# EAGLE schematic Seeeduino_V2.2 (EAGLE 5.11)
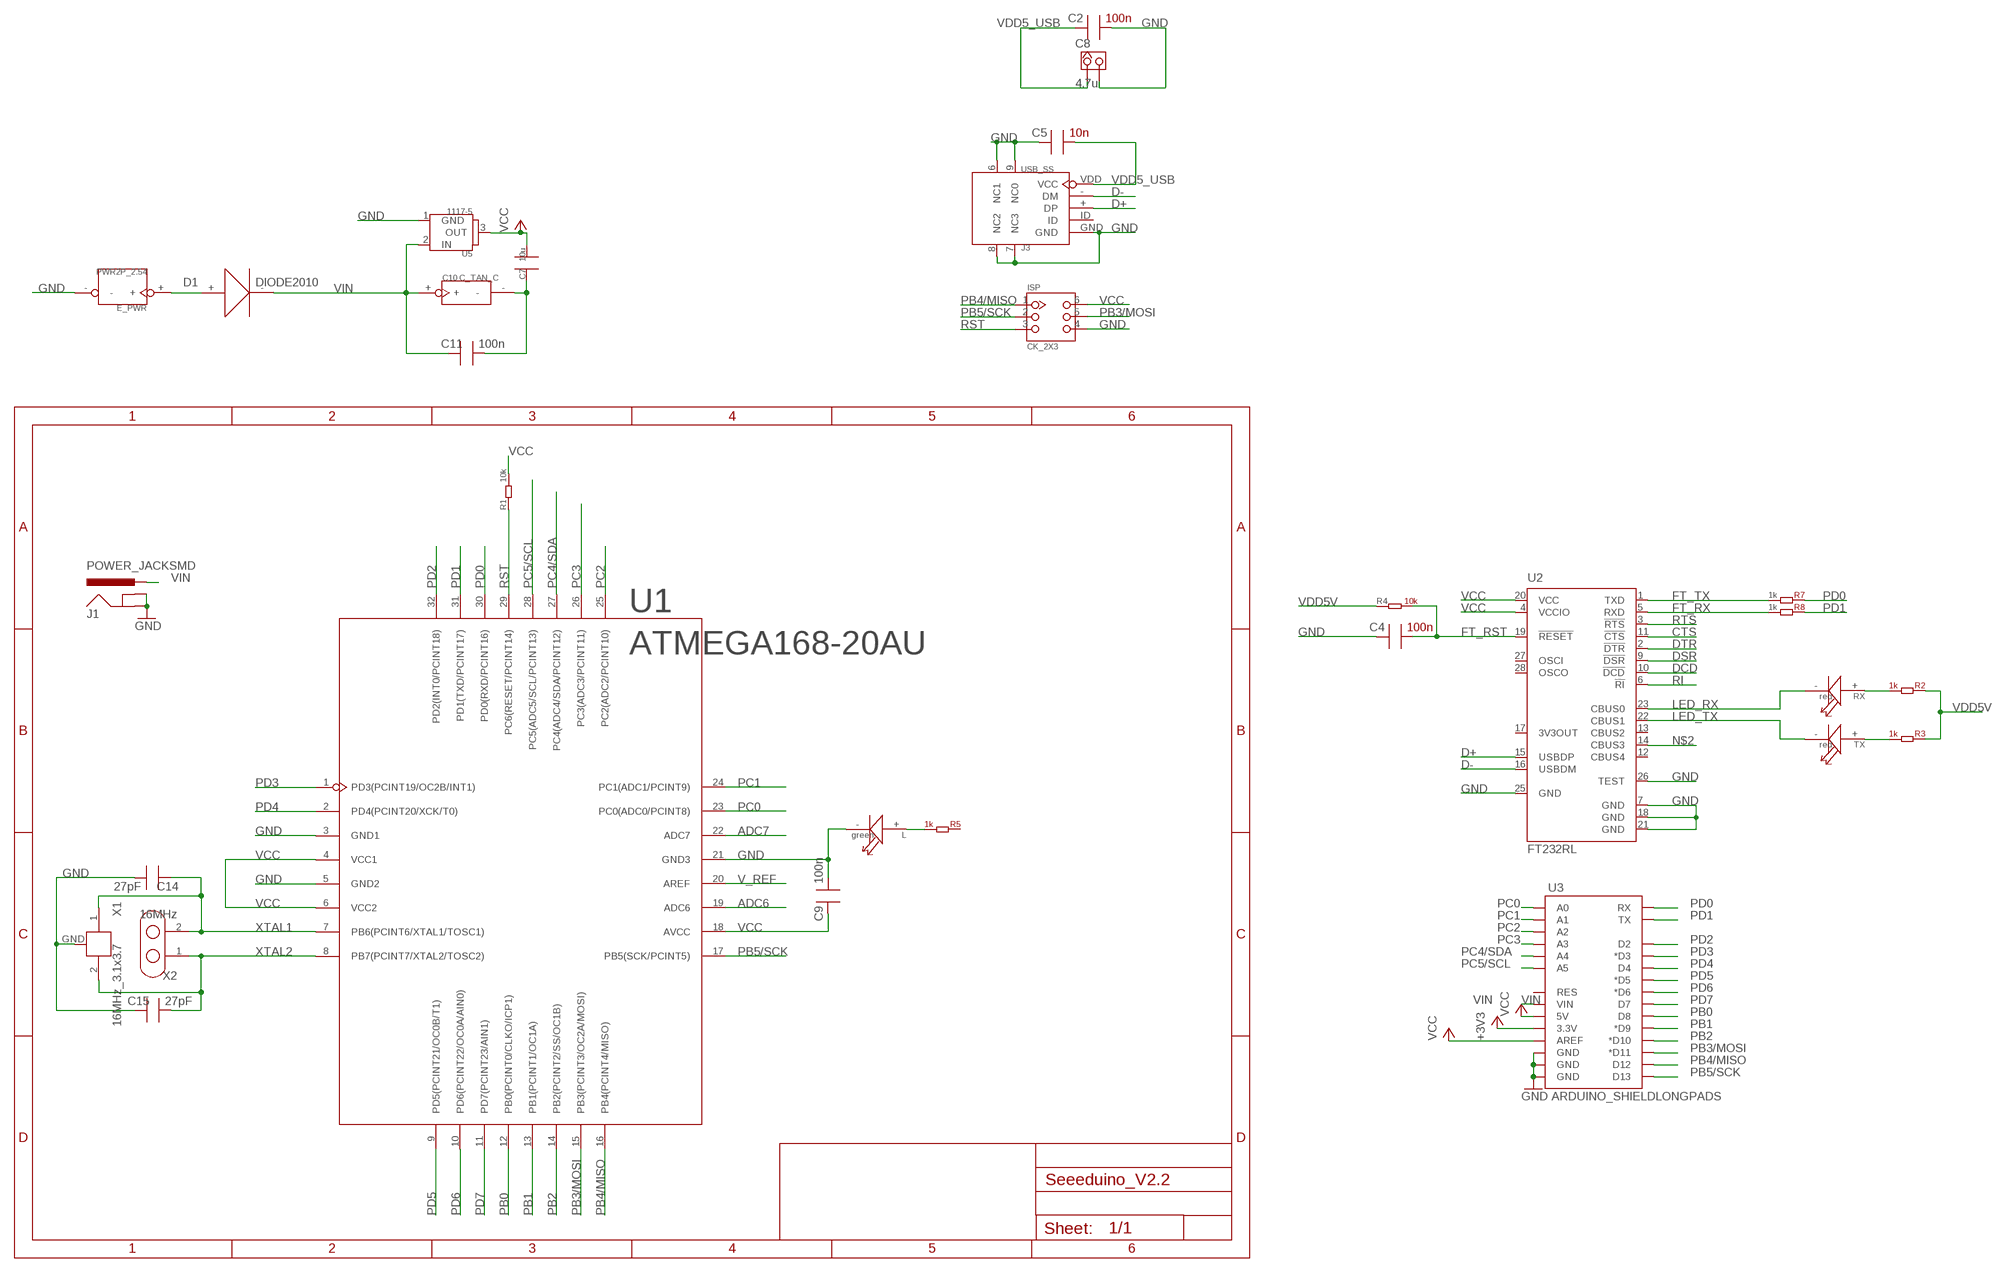
[diagram p0: schematic, sheet 1]

## Parts
C2  100n  C0603  [0603]
C4  100n  C0603  [0603]
C5  10n  C0603  [0603]
C7  10u  C0805  [0805]
C8  4.7u  CK_12  [CK_1*2]
C9  100n  C0603  [0603]
C10  C_TAN_C  [TYPE_C]
C11  100n  C0603  [0603]
C14  27pF  C0603  [0603]
C15  27pF  C0603  [0603]
D1  DIODE2010  [DIODE_2010]
E_PWR  PWR2P_2.54  [PWR_JST]
ISP  CK_2X3  CK_2X3_DD  [CK_2X3]
J1  POWER_JACKSMD  [POWER_JACK_SMD]
J3  USB_SS  [USB_B_S]
L  green  LED0805  [LED0805]
R1  10k  R0603  [0603]
R2  1k  R0603  [0603]
R3  1k  R0603  [0603]
R4  10k  R0603  [0603]
R5  1k  R0603  [0603]
R7  1k  R0603  [0603]
R8  1k  R0603  [0603]
RX  red  LED0805  [LED0805]
TX  red  LED0805  [LED0805]
U1  ATMEGA168-20AU  [ATMEGA168-20AU]
U2  FT232RL  [SSOP28]
U3  ARDUINO_SHIELDLONGPADS  [DUEMILANOVE_SHIELD_LONGPADS]
U5  1117-5  [TO252]
X1  16MHz_3.1x3.7  XTAL_NCHOZ  [XTAL_NC]
X2  16MHz  XTL_B  [XTL_B]

## Nets
+3V3: U3.3.3V
ADC6: U1.19(ADC6)
ADC7: U1.22(ADC7)
CTS: U2.11(!CTS)
D+: J3.+(DP) U2.15(USBDP)
D-: J3.-(DM) U2.16(USBDM)
DCD: U2.10(!DCD)
DSR: U2.9(!DSR)
DTR: U2.2(!DTR)
FT_RST: C4.2 R4.2 U2.19(!RESET)
FT_RX: R8.2 U2.5(RXD)
FT_TX: R7.2 U2.1(TXD)
GND: C2.2 C4.1 C5.1 C7.1 C8.2 C9.2 C10.- C11.2 C14.2 C15.1 E_PWR.- ISP.4 J1.GND(GNDBREAK) J1.P$4(GND) J3.6(NC1) J3.7(NC3) J3.8(NC2) J3.9(NC0) J3.GND L.- U1.3(GND1) U1.5(GND2) U1.21(GND3) U2.7(GND) U2.18(GND) U2.21(GND) U2.25(GND) U2.26(TEST) U3.GND@0(GND) U3.GND@1(GND) U3.GND@2(GND) U5.1(GND) X1.GND
LED_RX: RX.- U2.23(CBUS0)
LED_TX: TX.- U2.22(CBUS1)
N$1: D1.+ E_PWR.+
N$2: U2.14(CBUS3)
N$4: L.+ R5.2
N$31: R2.2 RX.+
N$32: R3.2 TX.+
PB0: U1.12(PB0(PCINT0/CLKO/ICP1)) U3.D8
PB1: U1.13(PB1(PCINT1/OC1A)) U3.D9(*D9)
PB2: U1.14(PB2(PCINT2/SS/OC1B)) U3.D10(*D10)
PB3/MOSI: ISP.5 U1.15(PB3(PCINT3/OC2A/MOSI)) U3.D11(*D11)
PB4/MISO: ISP.1 U1.16(PB4(PCINT4/MISO)) U3.D12
PB5/SCK: ISP.2 U1.17(PB5(SCK/PCINT5)) U3.D13
PC0: U1.23(PC0(ADC0/PCINT8)) U3.A0
PC1: U1.24(PC1(ADC1/PCINT9)) U3.A1
PC2: U1.25(PC2(ADC2/PCINT10)) U3.A2
PC3: U1.26(PC3(ADC3/PCINT11)) U3.A3
PC4/SDA: U1.27(PC4(ADC4/SDA/PCINT12)) U3.A4
PC5/SCL: U1.28(PC5(ADC5/SCL/PCINT13)) U3.A5
PD0: R7.1 U1.30(PD0(RXD/PCINT16)) U3.RX
PD1: R8.1 U1.31(PD1(TXD/PCINT17)) U3.TX
PD2: U1.32(PD2(INT0/PCINT18)) U3.D2
PD3: U1.1(PD3(PCINT19/OC2B/INT1)) U3.D3(*D3)
PD4: U1.2(PD4(PCINT20/XCK/T0)) U3.D4
PD5: U1.9(PD5(PCINT21/OC0B/T1)) U3.D5(*D5)
PD6: U1.10(PD6(PCINT22/OC0A/AIN0)) U3.D6(*D6)
PD7: U1.11(PD7(PCINT23/AIN1)) U3.D7
RI: U2.6(!RI)
RST: ISP.3 R1.1 U1.29(PC6(RESET/PCINT14))
RTS: U2.3(!RTS)
V_REF: U1.20(AREF)
VCC: C7.2 C9.1 ISP.6 R1.2 U1.4(VCC1) U1.6(VCC2) U1.18(AVCC) U2.4(VCCIO) U2.20(VCC) U3.5V U3.AREF U5.3(OUT)
VDD5_USB: C2.1 C5.2 C8.1 J3.VDD(VCC)
VDD5V [usbvcc]: R2.1 R3.1 R4.1
VIN: C10.+ C11.1 D1.- J1.VIN0(PWR) U3.VIN U5.2(IN)
XTAL1: C14.1 U1.7(PB6(PCINT6/XTAL1/TOSC1)) X1.1 X2.2
XTAL2: C15.2 U1.8(PB7(PCINT7/XTAL2/TOSC2)) X1.2 X2.1
Unconnected: J3.ID R5.1 U2.12(CBUS4) U2.13(CBUS2) U2.17(3V3OUT) U2.27(OSCI) U2.28(OSCO) U3.RES

## Library data of the parts
C2 C4 C5 C9 C11 C14 C15 = CPT_SMD:C0603; C0603: 100N
C7 = CPT_SMD:C0805
C8 = CONNECTER:CK_1*2
C10 = CPT_SMD:C_TAN
D1 = CPT_SMD:DIODE
E_PWR = CONNECTER:PWR2P_2.54
ISP = CONNECTER:CK_2X3
J1 = SparkFun:POWER_JACK: Power Jack This is the standard 5.5mm barrel jack for power. The PTH is the most common, proven, reliable, footprint. All others are experimental. The Slot footprint only works if the mill layer is transmitted to the PCB fab house so be warned. Spark Fun Electronics SKU : PRT-00119. Mating wall wart : TOL-00298 (and others)
J3 = CONNECTER:USB
L RX TX = CPT_SMD:LED0805
R1-R5 R7 R8 = CPT_SMD:R0603
U1 = IC_SMD:ATMEGA168-20AU
U2 = IC_SMD:FT232R: Source: http://www.ftdichip.com/Documents/DataSheets/DS_FT232R_v104.pdf
U3 = SparkFun:ARDUINO_SHIELD
U5 = ICs:1117-5
X1 = CPT_SMD:XTAL_NC
X2 = CPT_CJ:XTL_B

## Net classes
0 default: width 0.203 mm, drill 0.305 mm, clearance 0.203 mm
1 power: width 0.203 mm, drill 0.305 mm, clearance 0.203 mm
2 gnd: width 0.203 mm, drill 0.305 mm, clearance 0.203 mm
3 usbvcc: width 0.203 mm, drill 0.305 mm, clearance 0.203 mm